# EAGLE schematic ADE7953_WattMeter_breakout_v1.00 (EAGLE 7.7.0)
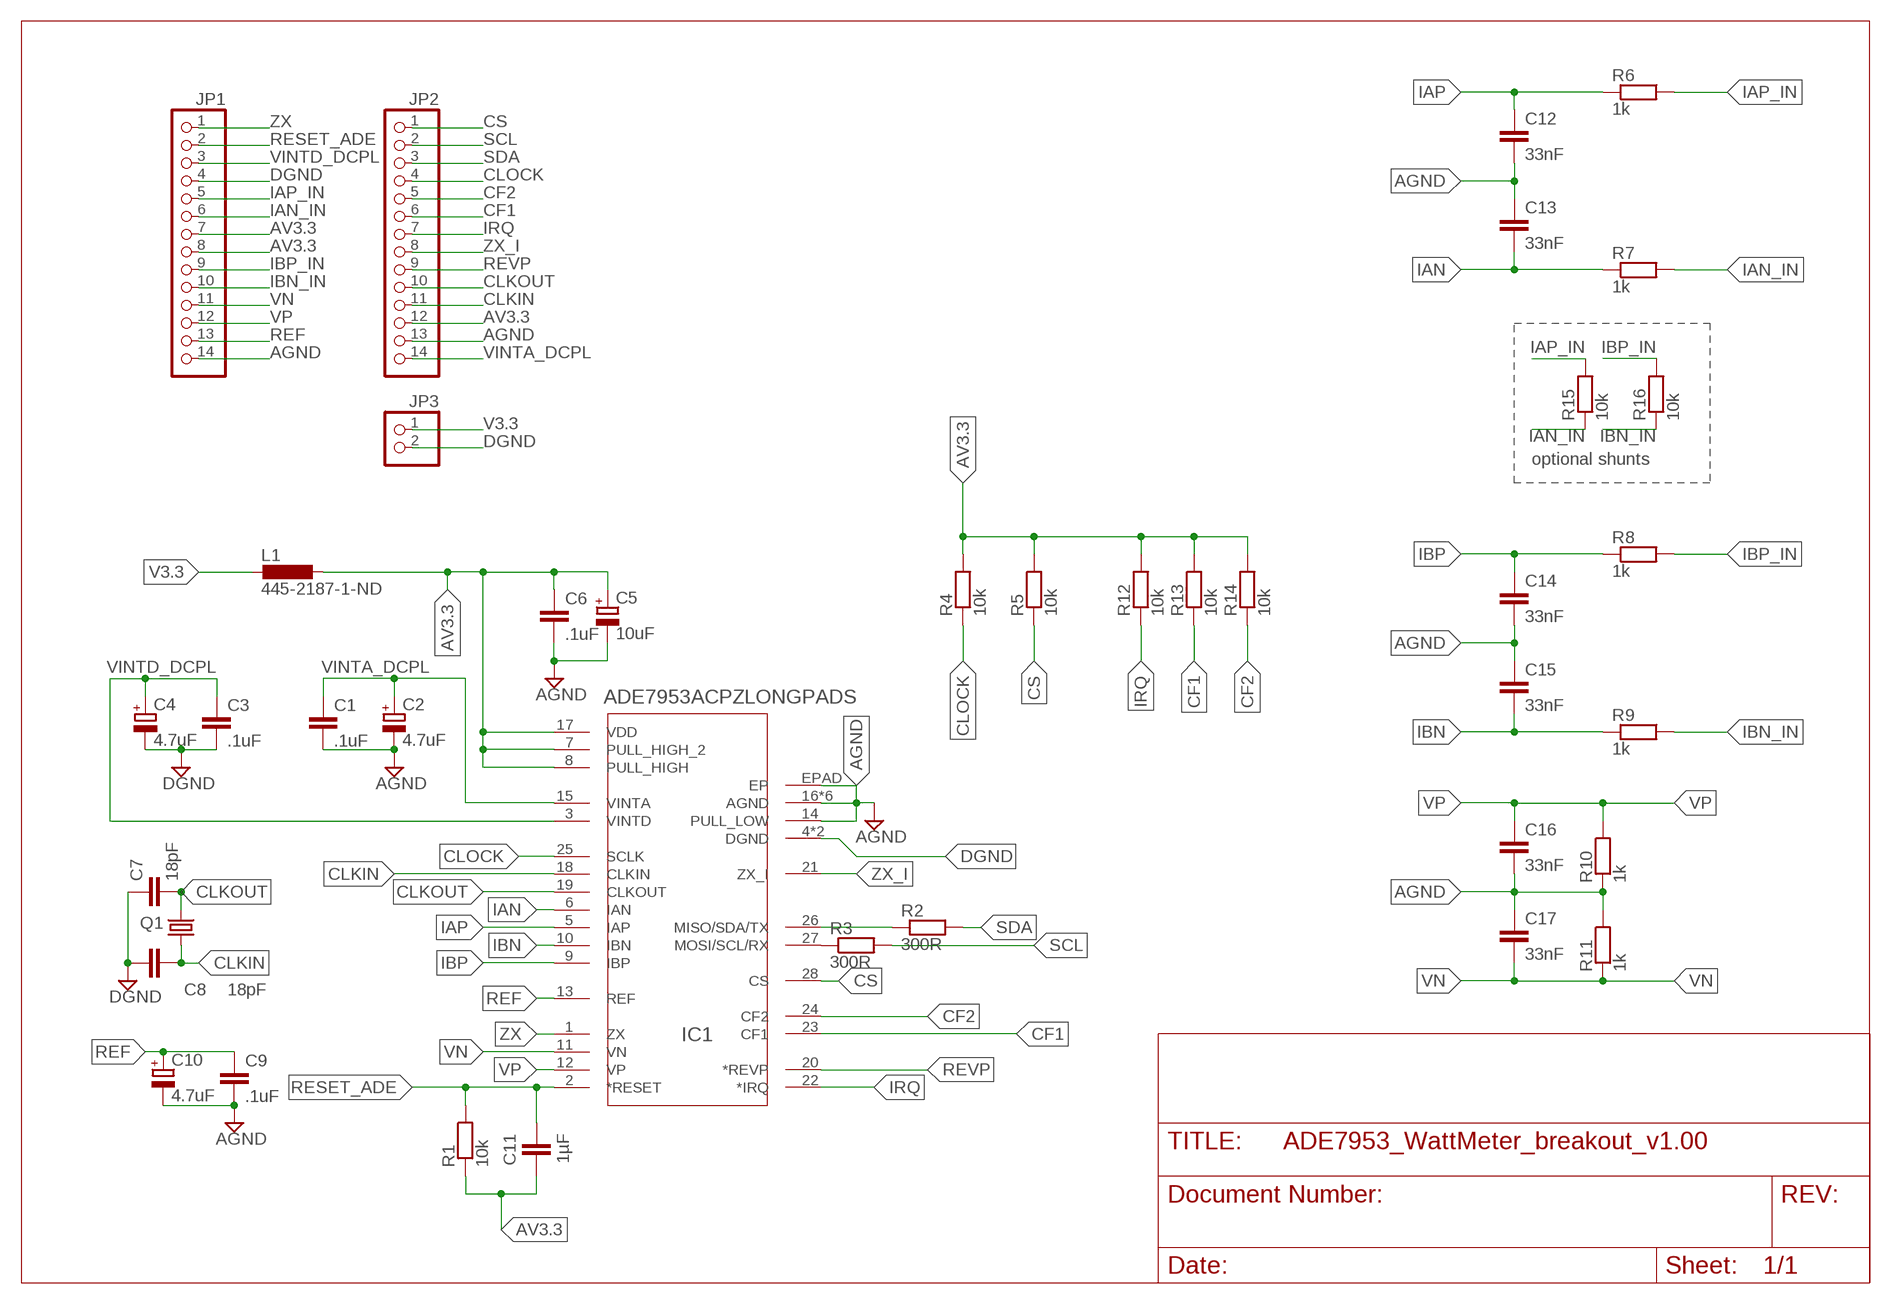
[diagram p0: schematic, sheet 1]

## Parts
C1  .1uF  C-EUC0805K  [C0805K@1]
C2  4.7uF  CPOL-EUA/3216-18R  [A/3216-18R]
C3  .1uF  C-EUC0805K  [C0805K@1]
C4  4.7uF  CPOL-EUA/3216-18R  [A/3216-18R]
C5  10uF  CPOL-EUA/3216-18R  [A/3216-18R]
C6  .1uF  C-EUC0805K  [C0805K@1]
C7  18pF  C-EUC0805K  [C0805K@1]
C8  18pF  C-EUC0805K  [C0805K@1]
C9  .1uF  C-EUC0805K  [C0805K@1]
C10  4.7uF  CPOL-EUA/3216-18R  [A/3216-18R]
C11  1µF  C-EUC0805K  [C0805K@1]
C12  33nF  C-EUC0805K  [C0805K@1]
C13  33nF  C-EUC0805K  [C0805K@1]
C14  33nF  C-EUC0805K  [C0805K@1]
C15  33nF  C-EUC0805K  [C0805K@1]
C16  33nF  C-EUC0805K  [C0805K@1]
C17  33nF  C-EUC0805K  [C0805K@1]
IC1  ADE7953ACPZLONGPADS  ADE7953ACPZ5.0  [VQFN-28-D]
JP1  PINHD-1X14  [1X14]
JP2  PINHD-1X14  [1X14]
JP3  PINHD-1X2  [1X02]
L1  445-2187-1-ND  L-EUL2012C  [L2012C]
Q1  535-10200-1-ND  CRYSTALSM49  [SM49]
R1  10k  R-US_R0805  [R0805@1]
R2  300R  R-US_R0805  [R0805@1]
R3  300R  R-US_R0805  [R0805@1]
R4  10k  R-US_R0805  [R0805@1]
R5  10k  R-US_R0805  [R0805@1]
R6  1k  R-US_R0805  [R0805@1]
R7  1k  R-US_R0805  [R0805@1]
R8  1k  R-US_R0805  [R0805@1]
R9  1k  R-US_R0805  [R0805@1]
R10  1k  R-US_R0805  [R0805@1]
R11  1k  R-US_R0805  [R0805@1]
R12  10k  R-US_R0805  [R0805@1]
R13  10k  R-US_R0805  [R0805@1]
R14  10k  R-US_R0805  [R0805@1]
R15  10k  R-US_R0805  [R0805@1]
R16  10k  R-US_R0805  [R0805@1]

## Nets
AGND: C1.2 C2.- C5.- C6.2 C9.2 C10.- C12.2 C13.1 C14.2 C15.1 C16.2 C17.1 IC1.14(PULL_LOW) IC1.16(AGND) IC1.29(AGND) IC1.30(AGND) IC1.31(AGND) IC1.32(AGND) IC1._AGND(AGND) IC1.EPAD(EP) JP1.14 JP2.13 R10.1 R11.2
AV3.3 [ic]: C5.+ C6.1 C11.2 IC1.7(PULL_HIGH_2) IC1.8(PULL_HIGH) IC1.17(VDD) JP1.7 JP1.8 JP2.12 L1.1 R1.1 R4.2 R5.2 R12.2 R13.2 R14.2
CF1 [ic]: IC1.23(CF1) JP2.6 R13.1
CF2 [ic]: IC1.24(CF2) JP2.5 R14.1
CLKIN [ic]: C8.2 IC1.18(CLKIN) JP2.11 Q1.1
CLKOUT [ic]: C7.2 IC1.19(CLKOUT) JP2.10 Q1.2
CLOCK [ic]: IC1.25(SCLK) JP2.4 R4.1
CS [ic]: IC1.28(CS) JP2.1 R5.1
DGND: C3.2 C4.- C7.1 C8.1 IC1.4(DGND) IC1._DGND(DGND) JP1.4 JP3.2
IAN [ic]: C13.2 IC1.6(IAN) R7.1
IAN_IN: JP1.6 R7.2 R15.1
IAP [ic]: C12.1 IC1.5(IAP) R6.1
IAP_IN: JP1.5 R6.2 R15.2
IBN [ic]: C15.2 IC1.10(IBN) R9.1
IBN_IN: JP1.10 R9.2 R16.1
IBP [ic]: C14.1 IC1.9(IBP) R8.1
IBP_IN: JP1.9 R8.2 R16.2
IRQ [ic]: IC1.22(*IRQ) JP2.7 R12.1
PIN26_MISO_SDA_TX [ic]: IC1.26(MISO/SDA/TX) R2.1
PIN27_MOSI_SCL_RX [ic]: IC1.27(MOSI/SCL/RX) R3.1
REF [ic]: C9.1 C10.+ IC1.13(REF) JP1.13
RESET_ADE [ic]: C11.1 IC1.2(*RESET) JP1.2 R1.2
REVP [ic]: IC1.20(*REVP) JP2.9
SCL: JP2.2 R3.2
SDA: JP2.3 R2.2
V3.3: JP3.1 L1.2
VINTA_DCPL [ic]: C1.1 C2.+ IC1.15(VINTA) JP2.14
VINTD_DCPL [ic]: C3.1 C4.+ IC1.3(VINTD) JP1.3
VN [ic]: C17.2 IC1.11(VN) JP1.11 R11.1
VP [ic]: C16.1 IC1.12(VP) JP1.12 R10.2
ZX [ic]: IC1.1(ZX) JP1.1
ZX_I [ic]: IC1.21(ZX_I) JP2.8

## Notes on the sheet
- optional shunts

## Library data of the parts
C1 C3 C6-C9 C11-C17 = resistor:C-EU: CAPACITOR, European symbol
C2 C4 C5 C10 = resistor:CPOL-EU: POLARIZED CAPACITOR, European symbol
IC1 = ade7953-2:ADE7953ACPZ
JP1 JP2 = pinhead:PINHD-1X14: PIN HEADER
JP3 = pinhead:PINHD-1X2: PIN HEADER
L1 = resistor:L-EU: INDUCTOR, European symbol
Q1 = crystal:CRYSTAL: CRYSTAL; OC_FARNELL: unknown; OC_NEWARK: unknown
R1-R16 = resistor:R-US_: RESISTOR, American symbol

## Net classes
0 default: width 0.203 mm, drill 0.508 mm, clearance 0.254 mm
1 HIGHVOLTAGE: width 0.254 mm, drill 0.508 mm, clearance 2.413 mm to class 0, clearance 1.27 mm
2 ic: width 0.152 mm, drill 0.305 mm, clearance 0.152 mm to class 0, clearance 2.413 mm to class 1, clearance 0.152 mm